# EAGLE design SCK_Ambient_v1.0 (EAGLE 6.4)

## Sheet 1 of 4
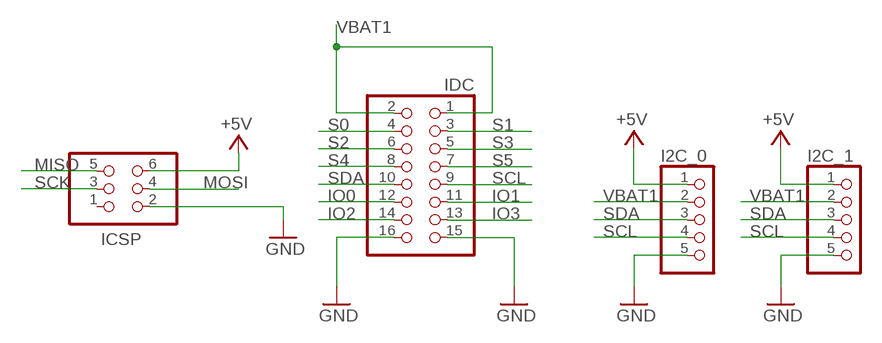
[diagram p0: schematic, sheet 1]

### Parts
I2C_0  PINHD-1X5  [1X05]
I2C_1  PINHD-1X5  [1X05]
ICSP  ICSP  PINHD-2X3  [2X03]
IDC  PINHD-2X8  [2X08]

### Nets
+5V [usbvcc]: I2C_0.1 I2C_1.1 ICSP.6 ; also sheet 2,3,4
GND: I2C_0.5 I2C_1.5 ICSP.2 IDC.15 IDC.16 ; also sheet 2,3,4
IO0: IDC.12 ; also sheet 3
IO1: IDC.11 ; also sheet 3
IO2: IDC.14 ; also sheet 3
IO3: IDC.13 ; also sheet 4
MISO: ICSP.5
MOSI: ICSP.4
S0: IDC.4 ; also sheet 3
S1: IDC.3 ; also sheet 3
S2: IDC.6 ; also sheet 3
S3: IDC.5 ; also sheet 3
S4: IDC.8 ; also sheet 2
S5: IDC.7 ; also sheet 2
SCK: ICSP.3
SCL: I2C_0.4 I2C_1.4 IDC.9 ; also sheet 3
SDA: I2C_0.3 I2C_1.3 IDC.10 ; also sheet 3
VBAT1: I2C_0.2 I2C_1.2 IDC.1 IDC.2 ; also sheet 3
Unconnected: ICSP.1

## Sheet 2 of 4
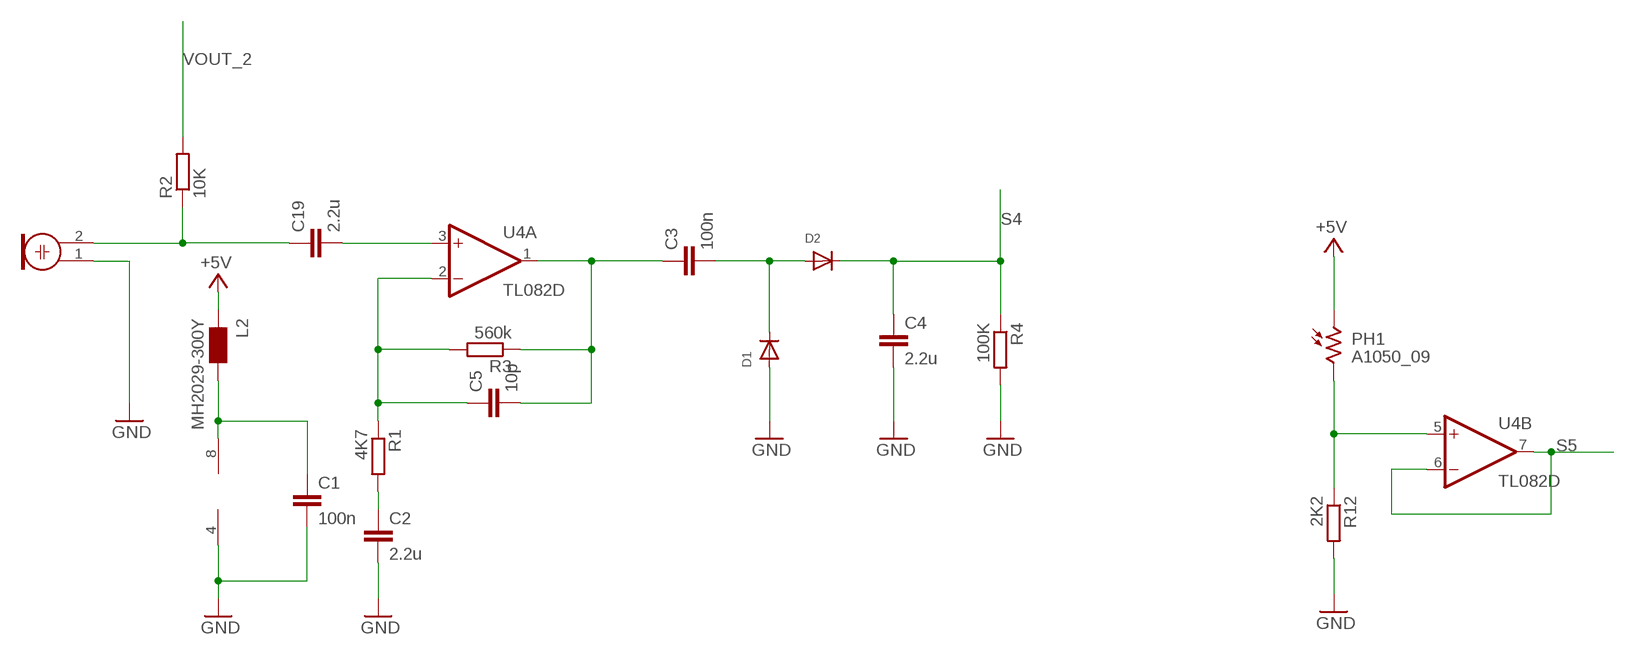
[diagram p1: schematic, sheet 2]

### Parts
C1  100n  C-EUC0805  [C0805]
C2  2.2u  C-EUC0805  [C0805]
C3  100n  C-EUC0805  [C0805]
C4  2.2u  C-EUC0805  [C0805]
C5  10p  C-EUC0805  [C0805]
C19  2.2u  C-EUC0805  [C0805]
D1  DIODESOD-123  [SOD-123]
D2  DIODESOD-123  [SOD-123]
L2  MH2029-300Y  WE-CBF_0805  [0805]
M1  ELECTRET_MICROPHON-WM-61A  [WM-61A]
PH1  A1050_09  [T0-46-A10XX]
R1  4K7  R-EU_R0805  [R0805]
R2  10K  R-EU_R0805  [R0805]
R3  560k  R-EU_R0805  [R0805]
R4  100K  R-EU_R0805  [R0805]
R12  2K2  R-EU_R0805  [R0805]
U4  TL082D  [SO08]

### Nets
+5V [usbvcc]: L2.1 PH1.1 ; also sheet 1,3,4
GND: C1.2 C2.2 C4.2 D1.A M1.1 R4.2 R12.2 U4.4(P:V-) ; also sheet 1,3,4
N$1: C19.1 M1.2 R2.1
N$2: C2.1 R1.2
N$3: C3.2 D1.C D2.A
N$4: C5.1 R1.1 R3.2 U4.2(A:-IN)
N$5: C3.1 C5.2 R3.1 U4.1(A:OUT)
N$6 [usbvcc]: C1.1 L2.2 U4.8(P:V+)
N$8: PH1.2 R12.1 U4.5(B:+IN)
N$9: C19.2 U4.3(A:+IN)
S4: C4.1 D2.C R4.1 ; also sheet 1
S5: U4.6(B:-IN) U4.7(B:OUT) ; also sheet 1
VOUT_2: R2.2 ; also sheet 3

## Sheet 3 of 4
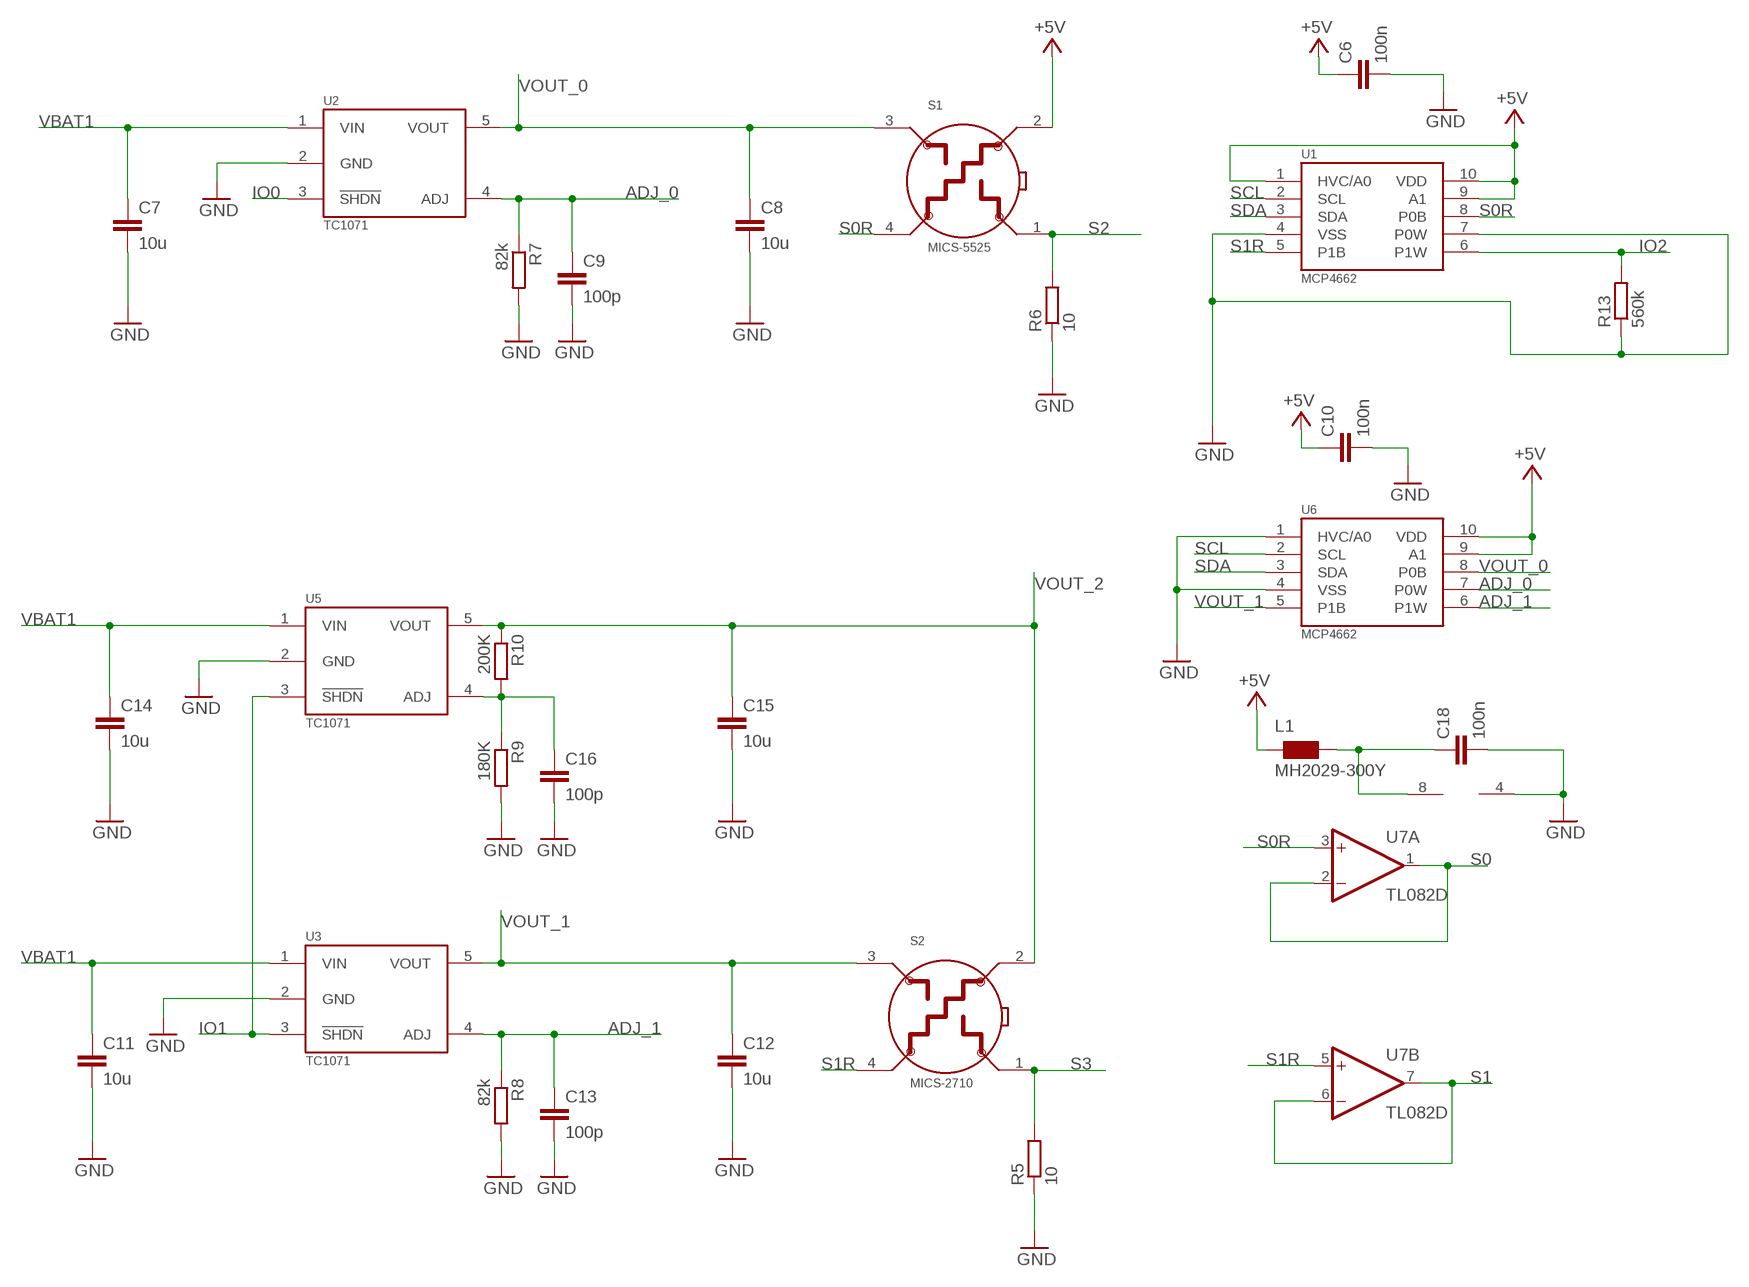
[diagram p2: schematic, sheet 3]

### Parts
C6  100n  C-EUC0805  [C0805]
C7  10u  C-EUC0805  [C0805]
C8  10u  C-EUC0805  [C0805]
C9  100p  C-EUC0805  [C0805]
C10  100n  C-EUC0805  [C0805]
C11  10u  C-EUC0805  [C0805]
C12  10u  C-EUC0805  [C0805]
C13  100p  C-EUC0805  [C0805]
C14  10u  C-EUC0805  [C0805]
C15  10u  C-EUC0805  [C0805]
C16  100p  C-EUC0805  [C0805]
C18  100n  C-EUC0805  [C0805]
L1  MH2029-300Y  WE-CBF_0805  [0805]
R5  10  R-EU_R0805  [R0805]
R6  10  R-EU_R0805  [R0805]
R7  82k  R-EU_R0805  [R0805]
R8  82k  R-EU_R0805  [R0805]
R9  180K  R-EU_R0805  [R0805]
R10  200K  R-EU_R0805  [R0805]
R13  560k  R-EU_R0805  [R0805]
S1  MICS-5525  E2V"  [E2V]
S2  MICS-2710  E2V"  [E2V]
U1  MCP4662  [MSOP10]
U2  TC1071  [SOT23-5L]
U3  TC1071  [SOT23-5L]
U5  TC1071  [SOT23-5L]
U6  MCP4662  [MSOP10]
U7  TL082D  [SO08]

### Nets
+5V [usbvcc]: C6.1 C10.1 L1.1 S1.2 U1.1(HVC/A0) U1.9(A1) U1.10(VDD) U6.9(A1) U6.10(VDD) ; also sheet 1,2,4
ADJ_0: C9.1 R7.1 U2.4(ADJ) U6.7(P0W)
ADJ_1: C13.1 R8.1 U3.4(ADJ) U6.6(P1W)
ADJ_2: C16.1 R9.1 R10.2 U5.4(ADJ)
GND: C6.2 C7.2 C8.2 C9.2 C10.2 C11.2 C12.2 C13.2 C14.2 C15.2 C16.2 C18.2 R5.1 R6.1 R7.2 R8.2 R9.2 R13.1 U1.4(VSS) U1.7(P0W) U2.2(GND) U3.2(GND) U5.2(GND) U6.1(HVC/A0) U6.4(VSS) U7.4(P:V-) ; also sheet 1,2,4
IO0: U2.3(!SHDN) ; also sheet 1
IO1: U3.3(!SHDN) U5.3(!SHDN) ; also sheet 1
IO2: R13.2 U1.6(P1W) ; also sheet 1
N$7 [usbvcc]: C18.1 L1.2 U7.8(P:V+)
S0: U7.1(A:OUT) U7.2(A:-IN) ; also sheet 1
S0R: S1.4 U1.8(P0B) U7.3(A:+IN)
S1: U7.6(B:-IN) U7.7(B:OUT) ; also sheet 1
S1R: S2.4 U1.5(P1B) U7.5(B:+IN)
S2: R6.2 S1.1 ; also sheet 1
S3: R5.2 S2.1 ; also sheet 1
SCL: U1.2(SCL) U6.2(SCL) ; also sheet 1
SDA: U1.3(SDA) U6.3(SDA) ; also sheet 1
VBAT1: C7.1 C11.1 C14.1 U2.1(VIN) U3.1(VIN) U5.1(VIN) ; also sheet 1
VOUT_0: C8.1 S1.3 U2.5(VOUT) U6.8(P0B)
VOUT_1: C12.1 S2.3 U3.5(VOUT) U6.5(P1B)
VOUT_2: C15.1 R10.1 S2.2 U5.5(VOUT) ; also sheet 2

## Sheet 4 of 4
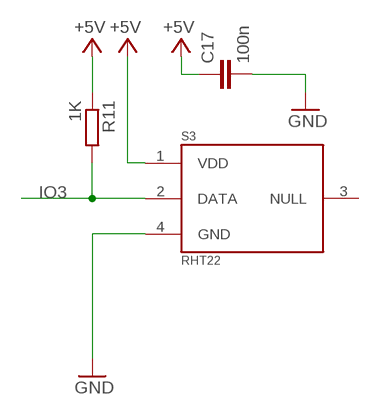
[diagram p3: schematic, sheet 4]

### Parts
C17  100n  C-EUC0805  [C0805]
R11  1K  R-EU_R0805  [R0805]
S3  RHT22  [RHT22]

### Nets
+5V [usbvcc]: C17.1 R11.1 S3.1(VDD) ; also sheet 1,2,3
GND: C17.2 S3.4(GND) ; also sheet 1,2,3
IO3: R11.2 S3.2(DATA) ; also sheet 1
Unconnected: S3.3(NULL)

## Library data of the parts
C1-C19 = rcl:C-EU: CAPACITOR, European symbol
D1 D2 = adafruit:DIODE: Diode SMADIODE - SMA Surface Mount Package 20V 1A Schottky Diode Digikey: 641-1014-6-ND DO-1N4148 - Through Hole Small Current Diode SOD-123 20V 1 A (.5mV Vf) Schottky Diode - Digikey: MBRX120TPMSCT-ND SOD-323 10V 570mA (.38mV Vf, 3ns) Schottky Diode - Digikey: ZLLS410CT-ND SOD-523 30V 30mA Schottky Diode (RB751S-40TE61) - Digikey: RB751S-40TE61CT-ND SOT23-R/W - SOT23 Package (R = Solder Paste/Reflow Ovens, W = Hand-Soldering) BAT54Film 40V 300mA - Digikey: 497-7162-1-ND
I2C_0 I2C_1 = pinhead:PINHD-1X5: PIN HEADER
ICSP = SmartPrj:PINHD-2X3: PIN HEADER
IDC = pinhead:PINHD-2X8: PIN HEADER
L1 L2 = wuerth-elektronik:WE-CBF: SMD EMI Suppression Ferrite Beads - excellent anti-EMI properties - low DCR - impedances till 3000 ohms - rated current up to 6 A
M1 = microphon:ELECTRET_MICROPHON-: Electret Condenser Microphone
PH1 = photo-elements:A10: Sensor Robust Light Sensing Applications Outdoor Light Sensing Application Source: http://optoelectronics.perkinelmer.com/content/Datasheets/DTS_PhotocellsA1050.pdf
R1-R13 = rcl:R-EU_: RESISTOR, European symbol
S1 S2 = Hangar:E2V
S3 = Hangar:RHT22
U1 U6 = Hangar:MCP4662
U2 U3 U5 = Hangar:TC1071
U4 U7 = linear:TL082: OP AMP

## Net classes
1 power: width 0.254 mm, drill 0.6 mm, clearance 0.203 mm
2 gnd: width 0.254 mm, drill 0.6 mm, clearance 0.203 mm
3 usbvcc: width 0.254 mm, drill 0.6 mm, clearance 0.203 mm
4 aref: width 0.254 mm, drill 0.6 mm, clearance 0.203 mm

## Board
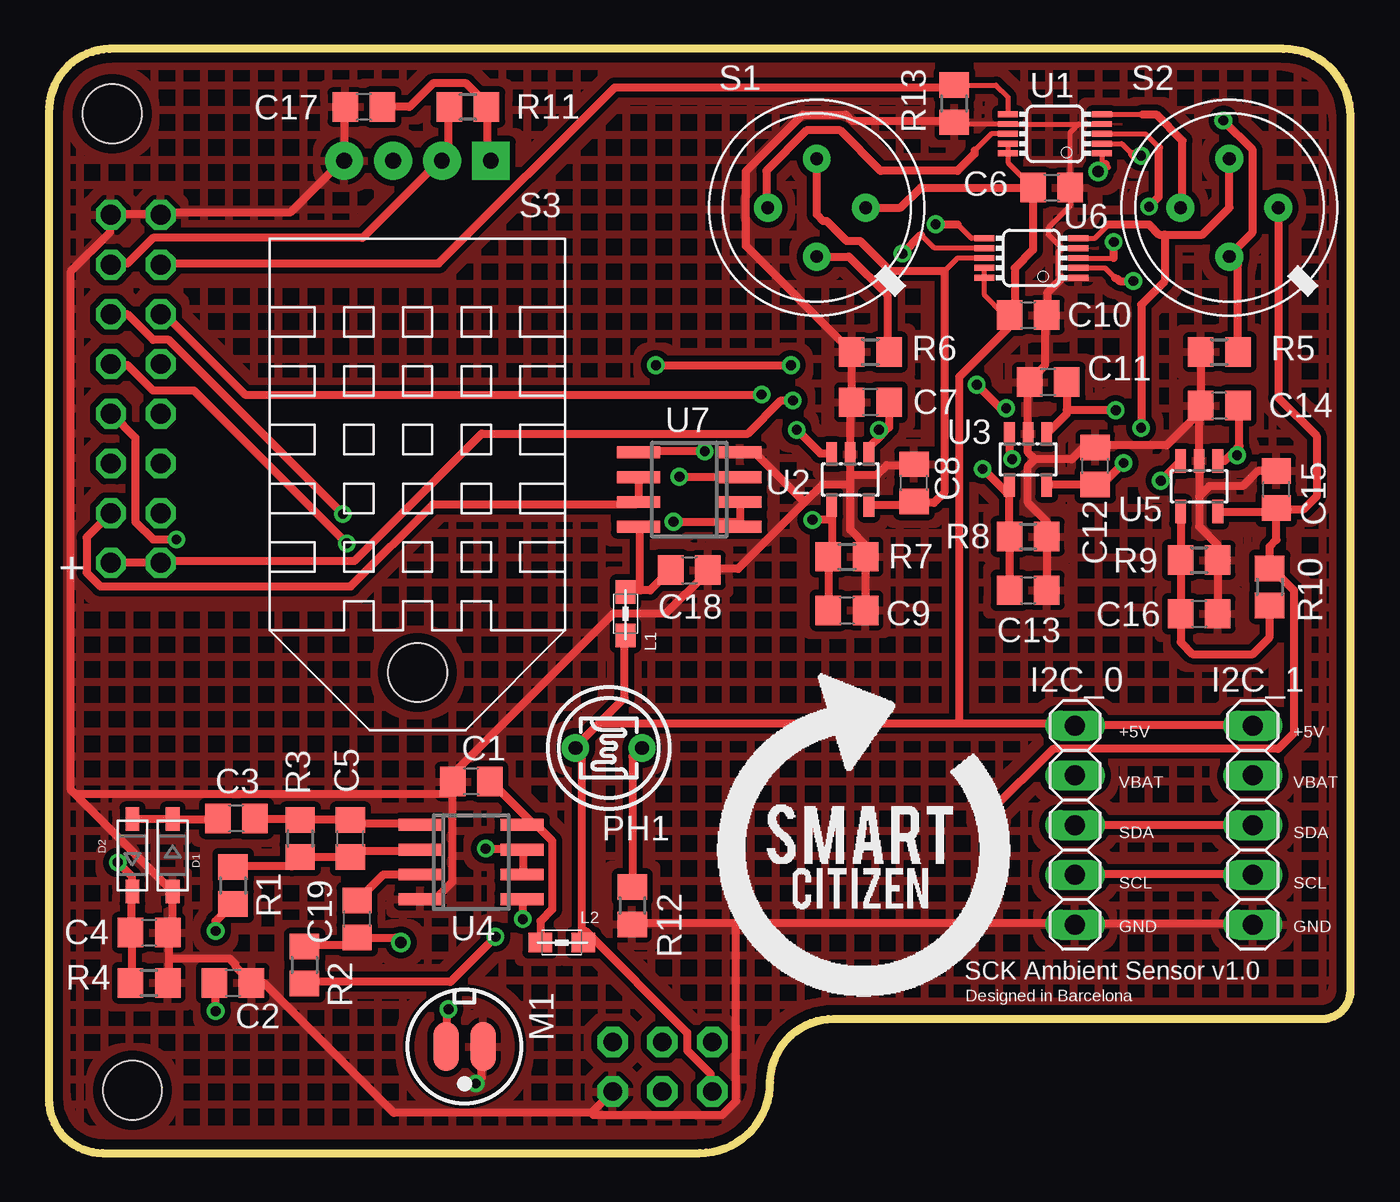
[diagram p4: board, top side]
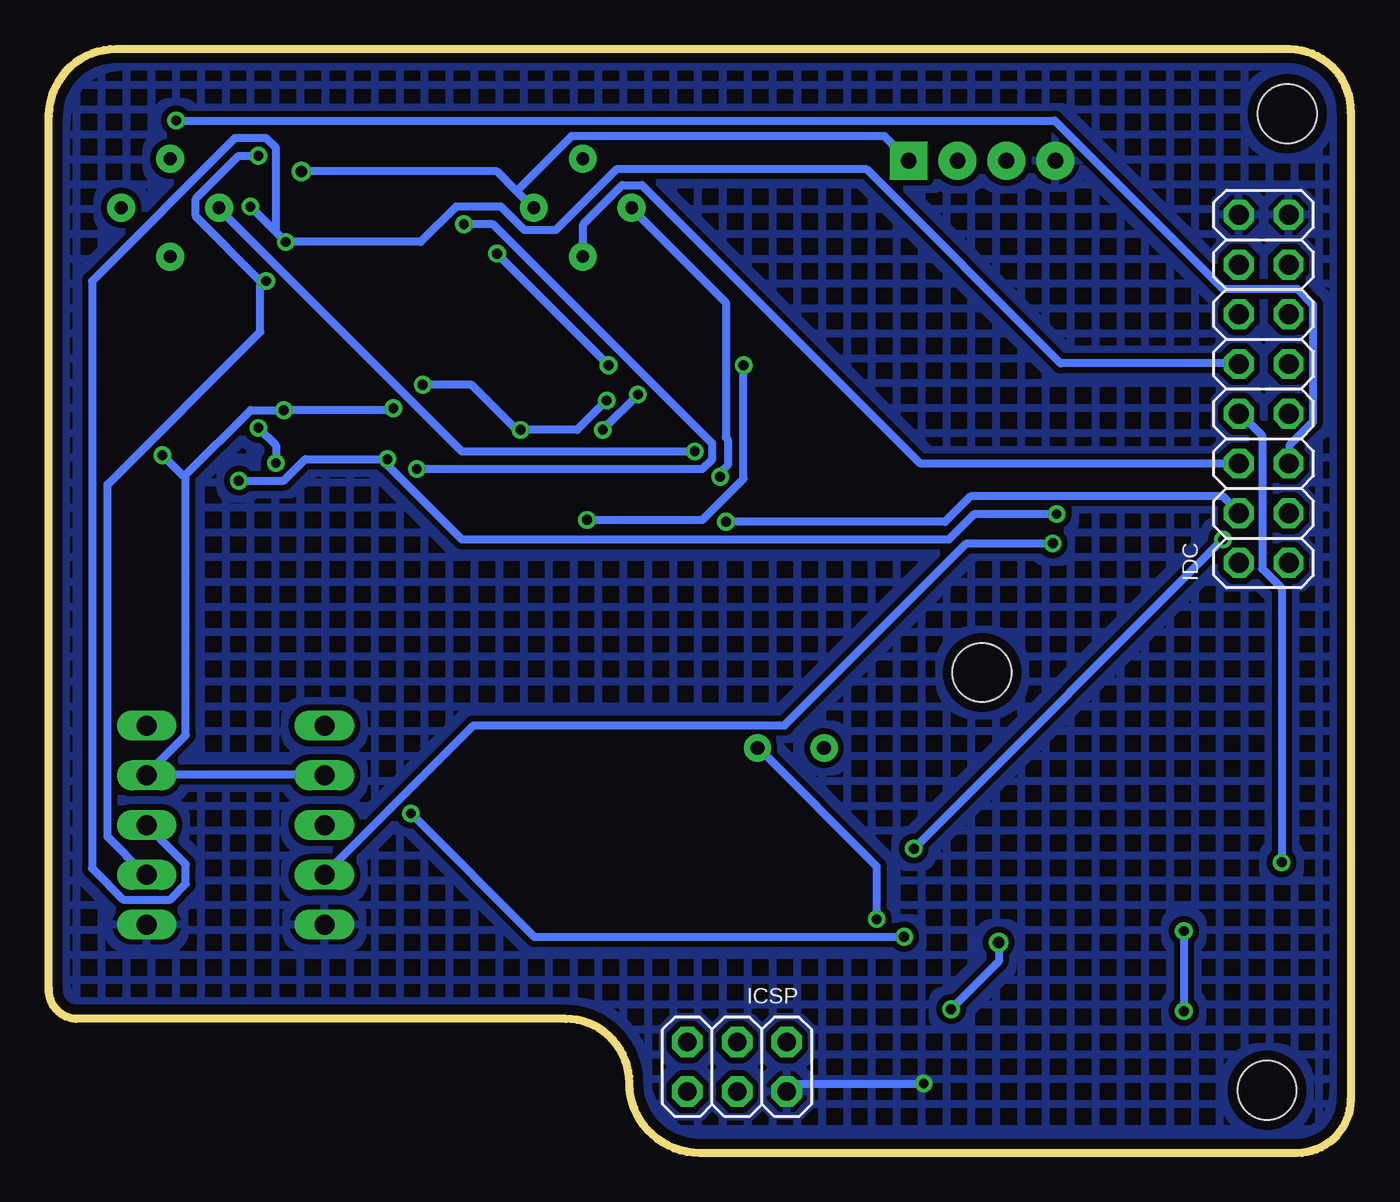
[diagram p5: board, bottom side, seen from below]

Size 66.52 x 56.41 mm. Coordinates in mm from the lower left corner, seen from the top.
Outline: 2.74,0 33.26,0 arc90 36.86,3.6 arc-90 40.12,6.86 65.15,6.86 arc90 66.52,8.4 66.52,52.98 arc90 63.09,56.41 3.09,56.41 arc90 0,53.15 0,2.74 arc90 2.74,0
Copper layers (1*16): Top 0.035mm / dielectric 1.5mm / Bottom 0.035mm
Design rules "default": minimum track width 16mil, minimum drill 0.5mm, track to track 12mil, track to pad 8mil, pad to pad 8mil, via to via 8mil, smd to smd 8mil, copper to edge 20mil, drill to drill 1mm, minimum pad ring 10mil, minimum via ring 0.2mm, stop-mask expansion 4mil, vias tented up to drill 0mil, thermal gap 10mil
Holes 3 mm at 3.24,53.1 4.27,3.21

### Footprints (pad centres in the part's own frame; a part is rotated, then mirrored left to right if it is on the bottom)
C0805 = smd 1.3 x 1.5: 1 -0.95,0; 2 0.95,0
SOD-123 = smd 1.2 x 0.7: A 1.85,0; C -1.85,0
1X05 = drill 1.016 long: 1 -5.08,0; 2 -2.54,0; 3 0,0; 4 2.54,0; 5 5.08,0
2X03 = drill 0.95 pad 1.55 octagon: 1 -2.54,-1.27; 2 -2.54,1.27; 3 0,-1.27; 4 0,1.27; 5 2.54,-1.27; 6 2.54,1.27
2X08 = drill 1.016 octagon: 1 -8.89,-1.27; 2 -8.89,1.27; 3 -6.35,-1.27; 4 -6.35,1.27; 5 -3.81,-1.27; 6 -3.81,1.27; 7 -1.27,-1.27; 8 -1.27,1.27; 9 1.27,-1.27; 10 1.27,1.27; 11 3.81,-1.27; 12 3.81,1.27; 13 6.35,-1.27; 14 6.35,1.27; 15 8.89,-1.27; 16 8.89,1.27
0805 = smd 1.2 x 1: 1 -1.1,0; 2 1.1,0
WM-61A = smd 2.5 x 1.3: 1 0,0.95; 2 0,-0.95
T0-46-A10XX = drill 0.7 pad 1.4: 1 -1.7,0; 2 1.7,0
R0805 = smd 1.3 x 1.5: 1 -0.95,0; 2 0.95,0
E2V = drill 0.65 pad 1.422: 1 0,-2.5; 2 2.5,0; 3 0,2.5; 4 -2.5,0
RHT22 = drill 0.8 pad 1.93 square: 1 -3.75,0 | drill 0.8 pad 1.93: 2 -1.25,0; 3 1.25,0; 4 3.75,0 | hole 3: 0,26.15
MSOP10 = smd 0.3 x 1.02: 1 -1,-2.4; 2 -0.5,-2.4; 3 0,-2.4; 4 0.5,-2.4; 5 1,-2.4; 6 1,2.4; 7 0.5,2.4; 8 0,2.4; 9 -0.5,2.4; 10 -1,2.4
SOT23-5L = smd 0.55 x 1.2: 1 -0.95,-1.3; 2 0,-1.3; 3 0.95,-1.3; 4 0.95,1.3; 5 -0.95,1.3
SO08 = smd 0.6 x 2.2: 1 -1.905,-2.6; 2 -0.635,-2.6; 3 0.635,-2.6; 4 1.905,-2.6; 5 1.905,2.6; 6 0.635,2.6; 7 -0.635,2.6; 8 -1.905,2.6

### Placement (x,y rotation side)
C1  21.58,18.98 180 top
C2  9.41,8.69 0 top
C3  9.58,17.09 180 top
C4  5.12,11.26 0 top
C5  15.41,16.06 90 top
C6  51.24,49.33 0 top
C7  41.98,38.35 180 top
C8  44.21,34.24 90 top
C9  40.78,27.72 0 top
C10  50.04,42.81 0 top
C11  51.07,39.38 180 top
C12  53.47,35.1 90 top
C13  50.04,28.75 0 top
C14  59.82,38.18 180 top
C15  62.73,33.9 90 top
C16  58.79,27.55 0 top
C17  16.1,53.44 180 top
C18  32.73,29.78 0 top
C19  15.75,11.95 90 top
D1  6.32,15.21 270 top
D2  4.27,15.21 90 top
I2C_0  52.44,16.75 270 top
I2C_1  61.53,16.75 270 top
ICSP  31.35,4.41 180 bottom
IDC  4.44,39.04 90 bottom
L1  29.47,27.55 90 top
L2  26.21,10.75 180 top
M1  21.24,5.43 270 top
PH1  28.61,20.69 0 top
R1  9.41,13.66 270 top
R2  13.06,9.6 270 top
R3  12.84,16.06 270 top
R4  5.12,8.69 0 top
R5  59.82,40.93 0 top
R6  41.98,40.93 0 top
R7  40.78,30.47 0 top
R8  50.04,31.5 0 top
R9  58.79,30.3 0 top
R10  62.39,28.92 270 top
R11  21.41,53.44 180 top
R12  29.81,12.64 270 top
R13  46.27,53.61 90 top
S1  39.24,48.3 0 top
S2  60.33,48.3 0 top
S3  18.84,50.7 180 top
U1  51.41,52.07 90 top
U2  40.96,34.41 180 top
U3  50.04,35.44 180 top
U4  21.58,14.86 270 top
U5  58.79,34.07 180 top
U6  50.21,45.73 90 top
U7  32.73,33.9 90 top

### Tracks (layer width: path | path; a pad name or v marks a point on that pad's centre or on a via)
+5V  (via drill 0.6)
  Top 0.254: U1.9 U1.10 49.01,50.6 C6.1 | U6.10 U6.9 | C10.1 48.84,42.81 47.81,43.84 U6.10 | U6.10 | U1.1 53.81,50.7 53.99,50.52 54.16,50.35
  Top 0.406: S1.2 43.53,48.3 44.56,49.33 C6.1 50.29,46.15 49.36,45.21 49.36,43.08 C10.1 49.02,42.65 49.02,42.15 46.52,39.65 46.52,21.95 | v53.62,50.15 53.99,50.52 | C17.1 17.12,53.45 18.42,53.45 19.62,54.65 21.32,54.65 22.32,53.65 22.32,53.45 R11.1 22.42,53.25 22.42,50.85 22.52,50.75 S3.1 | I2C_1.1 61.52,21.85 52.52,21.85 I2C_0.1 52.32,21.95 46.52,21.95 | 27.22,11.35 27.22,20.35 26.92,20.65 PH1.1 27.02,20.85 28.22,22.05 | 27.22,11.35 27.22,10.85 L2.1 | 28.22,22.05 29.42,23.25 29.42,26.45 L1.1 | ICSP.6 33.82,3.15 33.82,4.05 32.62,5.25 32.62,6.15 27.42,11.35 27.22,11.35 | 46.52,21.95 28.32,21.95 28.22,22.05
  Bottom 0.406: v53.62,50.15 43.62,50.15 42.62,49.15 | 42.62,49.15 41.82,48.35 S1.2 | 42.62,49.15 39.82,51.95 23.82,51.95 22.62,50.75 S3.1
ADJ_0  (via drill 0.5)
  Top 0.254: U6.7 45.26,46.23 44.58,46.9
  Top 0.406: U2.4 40.01,32.35 | 40.01,32.35 40.01,30.64 R7.1 C9.1 | v43.62,45.95 44.58,46.9 | v31.02,40.25 v37.92,40.25 | 40.01,32.35 v39.02,32.35
  Bottom 0.406: v37.92,40.25 v43.62,45.95 | v31.02,40.25 31.02,34.45 33.12,32.35 v39.02,32.35
ADJ_1  (via drill 0.5)
  Top 0.254: U6.6 47.16,46.73 46.44,47.44
  Top 0.406: C13.1 R8.1 U3.4 48.92,33.75 v47.72,34.95 | v45.32,47.45 46.32,47.45 46.44,47.44
  Bottom 0.406: v45.32,47.45 43.82,47.45 32.62,36.25 32.62,35.45 33.12,34.95 v47.72,34.95
ADJ_2
  Top 0.406: U5.4 R9.1 C16.1 57.84,26.1 58.44,25.49 61.53,25.49 62.39,26.35 R10.2
GND  (via drill 0.5)
  Top 0.254: R13.1 46.36,52.57 U1.7 52.61,52.57 | 52.61,52.57 U1.4 | 52.61,52.57 52.19,52.15 C6.2 52.19,48.39 51.07,47.27 51.07,46.93 51.77,46.23 | U6.4 51.77,46.23 | U6.1 51.73,44.73 51.59,44.87 51.59,46.04 51.77,46.23
  Top 0.406: 40.96,34.15 40.96,31.84 41.73,31.06 R7.2 C9.2 | 40.96,34.15 40.96,34.65 | 40.96,34.65 U2.2 40.96,38.27 C7.2 R6.1 40.92,41.05 35.62,46.35 35.62,50.15 38.52,53.05 40.72,53.05 41.02,52.75 46.22,52.75 R13.1 | C16.2 R9.2 59.74,31.06 58.79,32.01 58.79,33.55 | 58.79,33.55 U5.2 58.79,38.1 C14.2 | C15.2 61.79,34.85 61.02,34.07 59.3,34.07 58.79,33.55 | C13.2 R8.2 50.99,32.26 50.04,33.21 50.04,35.1 50.39,35.44 | R5.1 C14.2 | 50.39,35.44 52.27,35.44 52.88,36.05 C12.2 53.62,36.15 57.12,36.15 58.62,37.65 C14.2 | 50.39,35.44 50.04,35.78 U3.2 50.04,39.3 C11.2 50.22,39.55 50.92,40.25 50.92,42.65 C10.2 51.02,42.85 51.02,43.95 51.72,44.65 51.73,44.73 | C1.2 20.62,18.95 20.62,13.85 19.82,13.05 19.02,13.05 U4.4 | 38.62,33.25 39.52,34.15 40.96,34.15 | 38.62,33.25 35.22,29.85 33.72,29.85 C18.2 33.62,29.65 31.52,27.55 28.82,27.55 20.72,19.45 20.72,19.15 C1.2 | 40.96,34.65 42.32,34.65 42.82,35.15 44.12,35.15 C8.2 | 38.62,33.25 36.12,35.75 35.42,35.75 U7.4 | 35.12,11.75 52.42,11.75 I2C_0.5 52.62,11.75 61.52,11.75 I2C_1.5 | 35.12,11.75 29.82,11.75 R12.2 | C17.2 15.12,53.35 15.12,50.75 S3.4 14.92,50.65 12.32,48.05 5.82,48.05 IDC.16 5.62,47.95 3.22,47.95 IDC.15 3.12,47.75 3.12,47.05 1.12,45.05 1.12,18.55 1.42,18.25 | 6.12,9.95 6.12,11.15 C4.2 6.12,11.35 6.32,11.55 D1.A 6.22,13.45 1.42,18.25 | 6.12,9.95 6.12,8.75 R4.2 | 6.12,9.95 9.22,9.95 9.52,9.65 9.52,9.55 10.32,8.75 C2.2 10.52,8.65 11.02,8.65 17.62,2.05 27.72,2.05 | v21.82,3.55 22.12,3.85 22.12,5.35 M1.1 | 27.72,2.05 28.72,3.05 ICSP.2 | 35.12,11.75 35.12,2.65 34.42,1.95 27.82,1.95 27.72,2.05 | C1.2 20.42,18.35 1.52,18.35 1.42,18.25
  Bottom 0.406: v21.82,3.55 28.32,3.55 28.72,3.15 ICSP.2
  pour Top (hatched): -1.56,57.04 67.19,57.38 67.19,-0.39 -1.56,-0.74
  pour Bottom (hatched): -0.54,57.38 67.53,57.56 67.53,-0.39 -1.22,-0.57 -1.22,24.12
IO0  (via drill 0.5)
  Top 0.406: v38.22,36.95 39.42,35.75 39.92,35.75 U2.3 | v36.42,38.75 10.02,38.75 5.92,42.85 5.72,42.85 IDC.12
  Bottom 0.406: v36.42,38.75 v38.22,36.95
IO1  (via drill 0.5)
  Top 0.406: v49.22,35.45 49.12,35.55 49.12,36.65 U3.3 | v56.82,34.35 57.82,35.35 U5.3 | v15.02,32.65 6.12,41.55 5.32,41.55 4.02,42.85 3.22,42.85 IDC.11
  Bottom 0.406: v56.82,34.35 54.52,34.35 53.42,35.45 v49.22,35.45 49.32,35.25 45.42,31.35 20.52,31.35 19.22,32.65 v15.02,32.65
IO2
  Top 0.254: R13.2 48.41,54.56 49.01,53.96 U1.6 | U1.6
  Top 0.406: R13.2 46.22,54.45 28.92,54.45 19.92,45.45 5.72,45.45 IDC.14
IO3
  Top 0.406: R11.2 20.42,53.35 20.42,51.05 20.12,50.75 S3.2 19.92,50.65 16.02,46.75 5.32,46.75 4.02,45.45 3.22,45.45 IDC.13
N$1  (via drill 0.5, 0.6)
  Top 0.406: R2.1 13.12,10.65 15.4,10.65 C19.1 17.73,11 v17.98,10.75 | v20.42,7.35 20.32,7.25 20.32,5.45 M1.2
  Bottom 0.406: v17.98,10.75 17.98,9.79 v20.42,7.35
N$2  (via drill 0.5)
  Top 0.406: v8.52,7.25 8.52,8.65 C2.1 | v8.52,11.35 8.52,11.85 9.32,12.65 R1.2
  Bottom 0.406: v8.52,11.35 v8.52,7.25
N$3
  Top 0.406: D2.A 4.32,17.05 D1.C 6.52,17.05 8.62,17.05 C3.2
N$4
  Top 0.406: R1.1 9.42,14.65 12.42,14.65 12.82,15.05 R3.2 13.02,15.15 15.32,15.15 C5.1 15.52,15.25 15.72,15.45 18.92,15.45 U4.2
N$5
  Top 0.406: C3.1 10.62,17.05 12.82,17.05 R3.1 13.02,17.05 15.32,17.05 C5.2 15.52,16.85 18.92,16.85 U4.1
N$6
  Top 0.406: L2.2 25.12,10.85 25.12,11.85 25.72,12.45 25.72,15.95 24.92,16.75 24.22,16.75 U4.8 24.62,16.95 22.62,18.95 C1.1
N$7
  Top 0.406: 30.22,28.75 30.72,28.75 31.72,29.75 C18.1 | 30.22,28.75 29.52,28.75 L1.2 | 30.22,28.75 30.22,31.95 U7.8
N$8  (via drill 0.5)
  Top 0.406: R12.1 29.82,13.65 29.82,20.25 30.22,20.65 PH1.2 | v24.22,11.95 24.22,12.95 U4.5
  Bottom 0.406: v24.22,11.95 24.22,14.65 30.22,20.65 PH1.2
N$9
  Top 0.406: U4.3 17.08,14.23 C19.2
S0  (via drill 0.5)
  Top 0.406: U7.2 U7.1 35.22,32.25 v31.92,32.25
  Bottom 0.406: v31.92,32.25 20.72,32.25 19.42,33.55 6.52,33.55 5.72,32.75 IDC.4
S0R  (via drill 0.5)
  Top 0.254: U1.8 48.16,52.07 47.3,51.21
  Top 0.406: 47.3,51.21 47.3,51.04 46.44,50.18 42.5,50.18 40.44,52.24 38.73,52.24 36.67,50.18 36.67,48.37 S1.4 | v32.22,34.55 35.32,34.55 U7.3
  Bottom 0.406: v32.22,34.55 32.22,34.75 31.82,35.15 31.82,36.45 31.92,36.55 31.92,43.45 36.72,48.25 S1.4
S1
  Top 0.406: U7.6 U7.7 30.02,33.15 19.62,33.15 15.42,28.95 2.62,28.95 1.92,29.65 1.92,31.45 3.12,32.65 IDC.3
S1R  (via drill 0.5)
  Top 0.254: U1.5 55.9,53.07
  Top 0.406: 55.9,53.07 56.59,53.07 57.93,51.73 57.93,48.4 57.92,48.35 S2.4 | v33.52,35.85 30.22,35.85 U7.5
  Bottom 0.406: v33.52,35.85 45.42,35.85 57.82,48.25 S2.4
S2
  Top 0.406: S1.1 40.88,45.8 42.84,43.84 42.84,41.02 R6.2
  Bottom 0.406: IDC.6 5.72,35.25 22.02,35.25 36.22,49.45 37.22,49.45 39.22,47.45 39.22,45.85 S1.1
S3  (via drill 0.5)
  Top 0.406: R5.2 60.77,45.36 S2.1 60.42,45.95 61.52,47.05 61.52,51.25 v60.02,52.75
  Bottom 0.406: v60.02,52.75 15.12,52.75 6.52,44.15 2.72,44.15 1.92,43.35 1.92,37.35 3.12,36.15 3.12,35.25 IDC.5
S4  (via drill 0.5)
  Top 0.406: R4.1 4.22,8.75 4.22,11.15 C4.1 4.22,11.35 4.22,13.35 D2.C 4.22,13.55 4.22,14.15 v3.52,14.85
  Bottom 0.406: v3.52,14.85 3.52,28.85 4.52,29.85 4.52,36.65 5.62,37.75 IDC.8
S5  (via drill 0.5)
  Top 0.406: U4.6 24.22,14.25 24.22,15.45 U4.7 24.02,15.55 v22.32,15.55 | v6.52,31.35 5.32,31.35 4.42,32.25 4.42,36.55 3.22,37.75 IDC.7
  Bottom 0.406: v6.52,31.35 v22.32,15.55
SCL  (via drill 0.5)
  Top 0.254: U1.2 54.83,51.57 55.36,51.04 | U6.2 53.97,45.23 54.5,44.7
  Top 0.406: v55.82,50.95 55.42,50.95 55.36,51.04 | v55.42,44.55 54.72,44.55 54.62,44.65 54.5,44.7 | I2C_0.4 52.52,14.25 61.52,14.25 I2C_1.4 | v15.22,31.15 7.42,38.95 5.32,38.95 4.02,40.25 3.22,40.25 IDC.9
  Bottom 0.406: v55.82,50.95 56.82,50.95 59.02,48.75 59.02,47.85 55.72,44.55 v55.42,44.55 55.72,44.35 55.72,41.95 63.52,34.15 63.52,16.15 61.62,14.25 I2C_1.4 | v15.22,31.15 19.62,31.15 28.92,21.85 44.82,21.85 52.42,14.25 I2C_0.4
SDA  (via drill 0.5)
  Top 0.254: U1.3 56.04,52.07 56.73,51.38 | U6.3 54.42,45.73
  Top 0.406: I2C_0.3 52.52,16.75 I2C_1.3 | v56.22,48.35 56.72,48.85 56.72,51.35 56.73,51.38 | 54.42,45.73 v54.42,46.55
  Bottom 0.406: 55.02,47.15 v54.42,46.55 47.52,46.55 45.72,48.35 43.42,48.35 42.22,47.15 40.62,47.15 37.52,50.25 24.72,50.25 14.82,40.35 5.72,40.35 IDC.10 | 55.02,47.15 v56.22,48.35 | I2C_1.3 59.52,14.75 59.52,13.75 60.32,12.95 62.72,12.95 64.32,14.55 64.32,44.55 57.02,51.85 55.42,51.85 54.92,51.35 54.92,47.25 55.02,47.15
VBAT1  (via drill 0.5)
  Top 0.406: U2.1 41.91,36.05 42.57,36.71 | 42.57,36.71 42.93,37.07 C7.1 | U5.1 60.09,35.37 60.6,35.88 | 60.6,35.88 60.84,36.12 60.84,38.1 C14.1 | C11.1 52.02,37.95 | 52.02,37.95 52.02,37.77 U3.1 | v54.52,37.95 52.02,37.95 | v60.72,35.65 60.72,35.75 60.6,35.88 | v42.42,36.95 42.42,36.85 42.57,36.71 | v38.02,38.45 37.42,38.45 35.72,36.75 22.12,36.75 15.62,30.25 5.72,30.25 IDC.2 5.52,30.15 3.22,30.15 IDC.1 | v48.92,38.05 48.62,38.05 v47.42,39.25
  Bottom 0.406: 59.52,34.65 56.22,37.95 v54.52,37.95 49.02,37.95 v48.92,38.05 | 59.52,34.65 59.52,21.35 61.52,19.35 I2C_1.2 61.32,19.35 52.52,19.35 I2C_0.2 | v60.72,35.65 59.72,34.65 59.52,34.65 | v38.02,38.45 39.52,36.95 v42.42,36.95 42.62,36.95 44.92,39.25 v47.42,39.25
VOUT_0
  Top 0.254: U6.8 46.44,45.73 45.76,45.04
  Top 0.406: U2.5 44.04,33.11 C8.1 44.29,33.21 45.24,33.21 45.76,33.72 45.76,45.04 43.01,45.04 41.47,46.58 40.78,46.58 39.76,47.61 39.58,47.61 39.24,47.95 S1.3
VOUT_1  (via drill 0.5)
  Top 0.254: U6.5 53.44,46.73 54.16,47.44
  Top 0.406: 54.16,47.44 56.22,47.44 56.73,46.93 57.02,46.93 | 57.02,46.93 58.96,46.93 60.33,48.3 S2.3 | U3.5 C12.1 53.62,34.25 53.92,34.25 v54.92,35.25 | v55.82,37.05 55.82,43.35 57.02,44.55 57.02,46.93
  Bottom 0.406: v54.92,35.25 54.92,36.15 v55.82,37.05
VOUT_2  (via drill 0.5)
  Top 0.406: S2.2 62.83,38.6 64.79,36.64 64.79,33.55 64.1,32.87 62.81,32.87 C15.1 | U5.5 62.55,32.77 C15.1 | C15.1 62.73,31.32 62.39,30.98 R10.1 62.52,29.85 63.62,28.75 63.62,21.45 62.82,20.65 51.32,20.65 v48.02,17.35 | v22.82,11.05 20.52,8.75 13.12,8.75 R2.2
  Bottom 0.406: v22.82,11.05 41.72,11.05 v48.02,17.35

### Text on the board
tPlace: + | +5V | +5V | VBAT | VBAT | SDA | SDA | SCL | SCL | GND | GND | SCK Ambient Sensor v1.0 | Designed in Barcelona